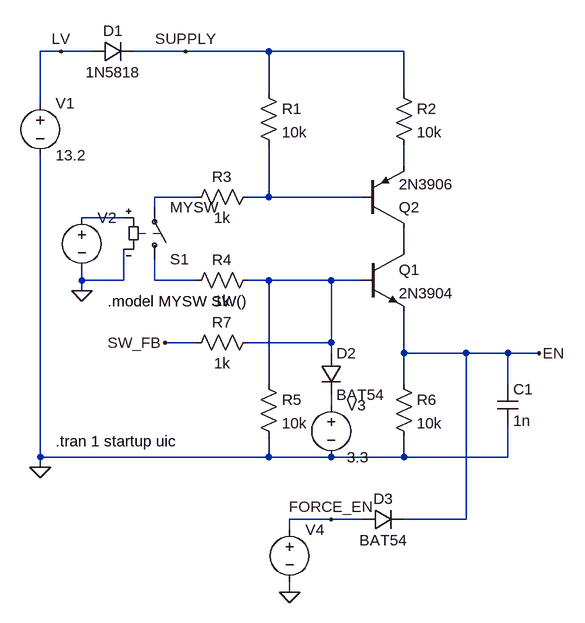
[diagram p0: schematic enable_loop.asc]
enable_loop.asc, the LTspice schematic file:
Version 4.1
SHEET 1 880 972
WIRE 96 128 64 128
WIRE 144 128 96 128
WIRE 288 128 208 128
WIRE 416 128 288 128
WIRE 624 128 416 128
WIRE 416 192 416 128
WIRE 624 192 624 128
WIRE 64 208 64 128
WIRE 624 304 624 272
WIRE 304 352 240 352
WIRE 416 352 416 272
WIRE 416 352 384 352
WIRE 560 352 416 352
WIRE 240 368 240 352
WIRE 192 384 128 384
WIRE 624 432 624 400
WIRE 128 480 128 464
WIRE 192 480 192 432
WIRE 192 480 128 480
WIRE 240 480 240 448
WIRE 304 480 240 480
WIRE 416 480 384 480
WIRE 512 480 416 480
WIRE 560 480 512 480
WIRE 128 496 128 480
WIRE 304 576 256 576
WIRE 512 576 512 480
WIRE 512 576 384 576
WIRE 512 592 512 576
WIRE 624 592 624 528
WIRE 720 592 624 592
WIRE 784 592 720 592
WIRE 832 592 784 592
WIRE 416 640 416 480
WIRE 624 640 624 592
WIRE 784 640 784 592
WIRE 512 672 512 656
WIRE 64 752 64 288
WIRE 416 752 416 720
WIRE 416 752 64 752
WIRE 512 752 416 752
WIRE 624 752 624 720
WIRE 624 752 512 752
WIRE 784 752 784 704
WIRE 784 752 624 752
WIRE 64 768 64 752
WIRE 512 848 448 848
WIRE 560 848 512 848
WIRE 720 848 720 592
WIRE 720 848 624 848
WIRE 448 864 448 848
WIRE 448 960 448 944
FLAG 64 768 0
FLAG 832 592 EN
FLAG 288 128 SUPPLY
FLAG 96 128 LV
FLAG 128 496 0
FLAG 256 576 SW_FB
FLAG 512 848 FORCE_EN
FLAG 448 960 0
SYMBOL voltage 64 192 R0
WINDOW 123 0 0 Left 0
WINDOW 39 0 0 Left 0
SYMATTR InstName V1
SYMATTR Value 13.2
SYMBOL diode 144 144 R270
WINDOW 0 32 32 VTop 2
WINDOW 3 0 32 VBottom 2
SYMATTR InstName D1
SYMATTR Value 1N5818
SYMATTR Description Diode
SYMATTR Type diode
SYMBOL res 400 176 R0
SYMATTR InstName R1
SYMATTR Value 10k
SYMBOL res 608 176 R0
SYMATTR InstName R2
SYMATTR Value 10k
SYMBOL npn 560 432 R0
SYMATTR InstName Q1
SYMATTR Value 2N3904
SYMBOL pnp 560 400 M180
SYMATTR InstName Q2
SYMATTR Value 2N3906
SYMBOL res 400 336 R90
WINDOW 0 0 56 VBottom 2
WINDOW 3 32 56 VTop 2
SYMATTR InstName R3
SYMATTR Value 1k
SYMBOL res 400 464 R90
WINDOW 0 0 56 VBottom 2
WINDOW 3 32 56 VTop 2
SYMATTR InstName R4
SYMATTR Value 1k
SYMBOL res 400 624 R0
SYMATTR InstName R5
SYMATTR Value 10k
SYMBOL res 608 624 R0
SYMATTR InstName R6
SYMATTR Value 10k
SYMBOL sw 240 464 M180
SYMATTR InstName S1
SYMATTR Value MYSW
SYMBOL voltage 128 368 R0
WINDOW 3 24 96 Invisible 2
WINDOW 123 0 0 Left 0
WINDOW 39 0 0 Left 0
SYMATTR InstName V2
SYMATTR Value PULSE(-1 1 0 1u 1u 100m 200m)
SYMBOL voltage 512 656 R0
WINDOW 123 0 0 Left 0
WINDOW 39 0 0 Left 0
SYMATTR InstName V3
SYMATTR Value 3.3
SYMBOL diode 496 592 R0
SYMATTR InstName D2
SYMATTR Value BAT54
SYMATTR Description Diode
SYMATTR Type diode
SYMBOL diode 560 864 R270
WINDOW 0 32 32 VTop 2
WINDOW 3 0 32 VBottom 2
SYMATTR InstName D3
SYMATTR Value BAT54
SYMATTR Description Diode
SYMATTR Type diode
SYMBOL res 400 560 R90
WINDOW 0 0 56 VBottom 2
WINDOW 3 32 56 VTop 2
SYMATTR InstName R7
SYMATTR Value 1k
SYMBOL voltage 448 848 R0
WINDOW 3 24 96 Invisible 2
WINDOW 123 0 0 Left 0
WINDOW 39 0 0 Left 0
SYMATTR InstName V4
SYMATTR Value PULSE(0 3.3 200m 1u 1u 300m 500m 1)
SYMBOL cap 768 640 R0
SYMATTR InstName C1
SYMATTR Value 1n
TEXT 168 512 Left 2 !.model MYSW SW()
TEXT 88 728 Left 2 !.tran 1 startup uic

The netlist it stands for:
* enable_loop.asc
V1 LV 0 13.2
D1 LV SUPPLY 1N5818
R1 SUPPLY N003 10k
R2 SUPPLY N001 10k
Q1 N005 N007 EN 0 2N3904
Q2 N005 N003 N001 0 2N3906
R3 N003 N002 1k
R4 N007 N006 1k
R5 N007 0 10k
R6 EN 0 10k
S1 N006 N002 N004 0 MYSW
V2 N004 0 PULSE(-1 1 0 1u 1u 100m 200m)
V3 N008 0 3.3
D2 N007 N008 BAT54
D3 FORCE_EN EN BAT54
R7 N007 SW_FB 1k
V4 FORCE_EN 0 PULSE(0 3.3 200m 1u 1u 300m 500m 1)
C1 EN 0 1n
.model D D
.lib standard.dio
.model NPN NPN
.model PNP PNP
.lib standard.bjt
.model MYSW SW()
.tran 1 startup uic
.backanno
.end